# EasyEDA Pro project SD-Swicharoo.eprj, schematic SD_Swicharoo
Board Name: SDSwicharoo_Lite; Create Date: 2025-05-26; Page Name: SDSwicharoo_Lite; Project Name: Swicharoo-Final; Schematic Name: SDSwicharoo_Lite; Update Date: 2025-08-05; Company: EasyEDA.com; Page Size: A2; Version: V1.0
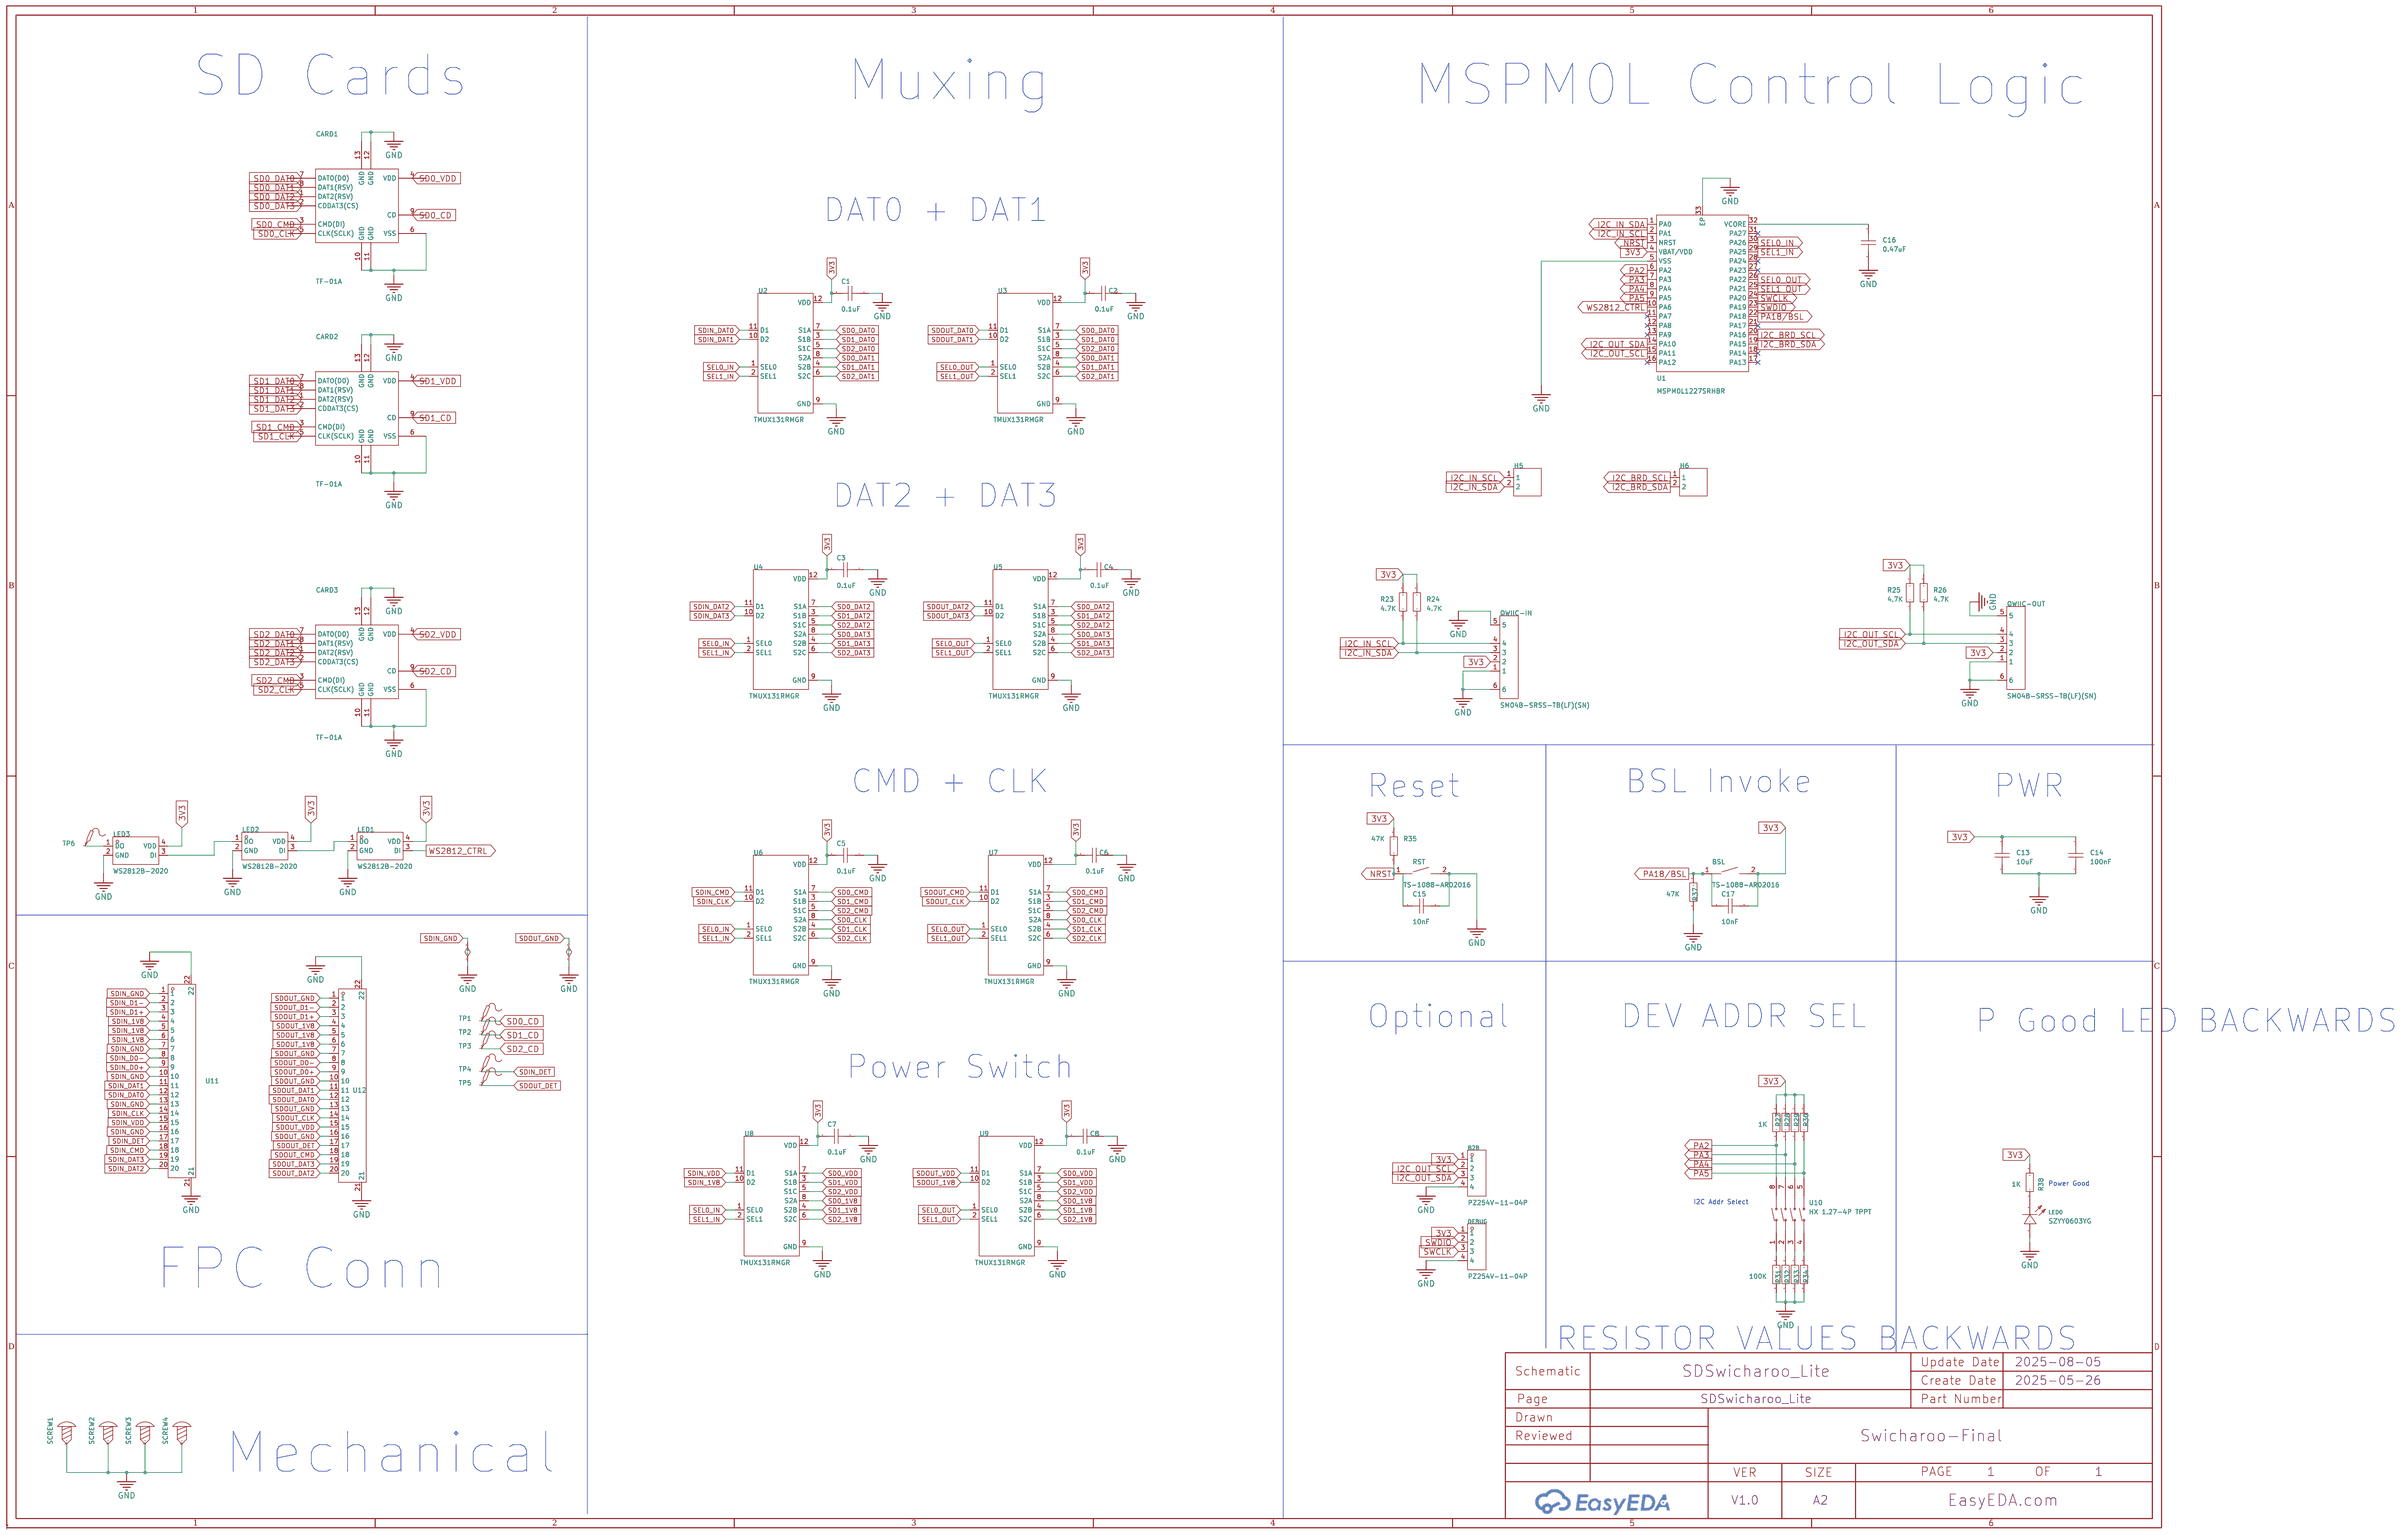
[diagram p0: schematic sheet]

## Parts
B2B  PZ254V-11-04P  [HDR-TH_4P-P2.54-V-M]  (no BOM)
BSL  TS-1088-AR02016  [SW-SMD_L3.9-W3.0-P4.45]
C1  0.1uF  [C0603]
C2  0.1uF  [C0603]
C3  0.1uF  [C0603]
C4  0.1uF  [C0603]
C5  0.1uF  [C0603]
C6  0.1uF  [C0603]
C7  0.1uF  [C0603]
C8  0.1uF  [C0603]
C13  10uF  [C0603]
C14  100nF  [C0603]
C15  10nF  [C0603]
C16  0.47uF  [C0603]
C17  10nF  [C0603]
CARD1  TF-01A  [TF-SMD_TF-01A]
CARD2  TF-01A  [TF-SMD_TF-01A]
CARD3  TF-01A  [TF-SMD_TF-01A]
DEBUG  PZ254V-11-04P  [HDR-TH_4P-P2.54-V-M]  (no BOM)
H5  -  [HDR-TH_2P-P2.54-V-M-1]  (no BOM)
H6  -  [HDR-TH_2P-P2.54-V-M-1]  (no BOM)
LED0  SZYY0603YG  [LED0603-R-RD_GREEN]
LED1  WS2812B-2020  [LED-SMD_4P-L2.0-W2.0-TL_WS2812B-2020]
LED2  WS2812B-2020  [LED-SMD_4P-L2.0-W2.0-TL_WS2812B-2020]
LED3  WS2812B-2020  [LED-SMD_4P-L2.0-W2.0-TL_WS2812B-2020]
QWIIC-IN  SM04B-SRSS-TB(LF)(SN)  [CONN-SMD_4P-P1.00_SM04B-SRSS-TB-LF-SN]
QWIIC-OUT  SM04B-SRSS-TB(LF)(SN)  [CONN-SMD_4P-P1.00_SM04B-SRSS-TB-LF-SN]
R23  4.7K  [R0603]
R24  4.7K  [R0603]
R25  4.7K  [R0603]
R26  4.7K  [R0603]
R27  1K  [R0603]
R28  1K  [R0603]
R29  1K  [R0603]
R30  1K  [R0603]
R31  100K  [R0603]
R32  1K  [R0603]
R33  1K  [R0603]
R34  1K  [R0603]
R35  47K  [R0603]
R37  47K  [R0603]
R38  1K  [R0603]
RST  TS-1088-AR02016  [SW-SMD_L3.9-W3.0-P4.45]
SCREW1  -  [Screw-Hole-M2]
SCREW2  -  [Screw-Hole-M2]
SCREW3  -  [Screw-Hole-M2]
SCREW4  -  [Screw-Hole-M2]
TP1  -  [Test-Point-0.5mm]
TP2  -  [Test-Point-0.5mm]
TP3  -  [Test-Point-0.5mm]
TP4  -  [Test-Point-0.5mm]
TP5  -  [Test-Point-0.5mm]
TP6  -  [Test-Point-0.5mm]
U1  MSPM0L1227SRHBR  [VQFN-32_L5.0-W5.0-P0.50-TL-EP3.5]
U2  TMUX131RMGR  [QFN-12L_L1.8-W1.8-P0.40-TL_TS3USB3031RMGR]
U3  TMUX131RMGR  [QFN-12L_L1.8-W1.8-P0.40-TL_TS3USB3031RMGR]
U4  TMUX131RMGR  [QFN-12L_L1.8-W1.8-P0.40-TL_TS3USB3031RMGR]
U5  TMUX131RMGR  [QFN-12L_L1.8-W1.8-P0.40-TL_TS3USB3031RMGR]
U6  TMUX131RMGR  [QFN-12L_L1.8-W1.8-P0.40-TL_TS3USB3031RMGR]
U7  TMUX131RMGR  [QFN-12L_L1.8-W1.8-P0.40-TL_TS3USB3031RMGR]
U8  TMUX131RMGR  [QFN-12L_L1.8-W1.8-P0.40-TL_TS3USB3031RMGR]
U9  TMUX131RMGR  [QFN-12L_L1.8-W1.8-P0.40-TL_TS3USB3031RMGR]
U10  HX 1.27-4P TPPT  [SW-SMD_8P-P1.27-L6.7-W5.4]
U11  05A20L20P  [FPC-SMD_20P-P0.50_L5.9-W14.4]
U12  05A20L20P  [FPC-SMD_20P-P0.50_L5.9-W14.4]

## Library data of the parts
B2B DEBUG = PZ254V-11-04P: Pin Structure:1x4P Pitch:2.54mm Row Spacing:- Circluar Pins/Square Pins:Square Pins Mounting Type:Straight Number of Rows:Plugin Number of Pins:4P Current Rating (Max):3A Voltage Rating (Max):250V Length of Mating Pin:6mm Insulation Height:2.5mm Length of; Color: Black; Pitch: 2.54mm; Supplier: LCSC; Datasheet: https://atta.szlcsc.com/upload/public/pdf/source/20200309/C492403_F9F19131791D08044AD4F84F8E751A34.pdf; Manufacturer: XFCN(兴飞); Mounting Type: Straight; Pin Structure: 1x4P; Supplier Part: C2691448; LCSC Part Name: 间距:2.54mm 1x4P 直插 方针; Number of Pins: 4P; Number of Rows: Plugin; Insulation Height: 2.5mm; JLCPCB Part Class: Extended Part; Supplier Footprint: 插件,P=2.54mm; Current Rating (Max): 3A; Length of Mating Pin: 6mm; Voltage Rating (Max): 250V; Circluar Pins/Square Pins: Square Pins; Operating Temperature Range: -40℃~+105℃; Length of End Connection Pin: 3mm; Check: false
BSL RST = TS-1088-AR02016: LCSC Part Name: 4*3*2mm 立贴 轻触开关; Supplier Part: C720477; Manufacturer: XUNPU(讯普); Supplier Footprint: SMD; JLCPCB Part Class: Basic Part; Datasheet: https://atta.szlcsc.com/upload/public/pdf/source/20200810/C720475_60D09DD6C54279ADDB2DC25100F1CC11.pdf; Supplier: LCSC; Circuit: SPST; Actuator Style: Round Button; Operating Force: 160gf; Mounting Style: Brick nogging; Switch Length: 4mm; Switch Width: 3mm; Switch Height: 2mm; Strike Gundam: 不带; Contact Current: 50mA; Voltage Rating (DC): 12V; Insulation Resistance: 100MΩ; Actuator/Cap Color: Black; Pin Style: SMDSplicing; Mechanical Life: 10万次; Operating Temperature: -30℃~+80℃
C1-C8 C13-C17 = CAP_0603: Supplier Footprint: 0603
CARD1-CARD3 = TF-01A_C91145: Card Connection Mode:Self-bouncing Card Type:MicroSD card (TF card) Connector Type:Card Slot Additional Card Detection Pins:- Supplementary Features:With Locating Pin Maximum Body Height:1.85mm Operating Temperature Range:- Operating Temperature Range:-; Supplier: LCSC; Card Type: MicroSD card (TF card); Datasheet: https://atta.szlcsc.com/upload/public/pdf/source/20190322/C91145_63CBD6FB4639A3A3EC6A9721F18AE0FB.pdf; Manufacturer: 韩国韩荣; Supplier Part: C91145; Connector Type: Card Slot; LCSC Part Name: 自弹式 MicroSD卡(TF卡) 卡座; JLCPCB Part Class: Extended Part; Supplier Footprint: SMD; Maximum Body Height: 1.85mm; Card Connection Mode: Self-bouncing; Supplementary Features: With Locating Pin
H5 H6 = HDR-M_2.54_1x2P: Supplier Footprint: Through
LED0 = SZYY0603YG: Emitted Color:Green-yellow; Supplier: LCSC; Datasheet: https://atta.szlcsc.com/upload/public/pdf/source/20191204/C434423_A1540F327AC0495CFC4F5F4A5CB9D8CC.pdf; Manufacturer: yongyu(永裕光电); Emitted Color: Green-yellow; Supplier Part: C434423; LCSC Part Name: 普绿/黄绿; JLCPCB Part Class: Extended Part; Supplier Footprint: 0603
LED1-LED3 = WS2812B-2020: LCSC Part Name: RGB三色; Supplier Part: C965555; Manufacturer: worldsemi; Supplier Footprint: SMD,2x2mm; JLCPCB Part Class: Extended Part; Datasheet: https://atta.szlcsc.com/upload/public/pdf/source/20241202/DEE3FC25B8AD87F3BB1718ACD77EDECD.pdf; Supplier: LCSC; Wavelength: 515.6nm；622.5nm；470.4nm
QWIIC-IN QWIIC-OUT = SM04B-SRSS-TB(LF)(SN): Pins Structure:1x4P Pitch:1mm Mounting Style:Horizontal attachment Reference Series:SH Number of Pins:4P Number of Rows:1 Number of PINs Per Row:4 Row Spacing:- Current Rating (Max):1A Contact Material:Copper alloy Contact Plating:Tin Operating Temperatur; Pitch: 1mm; Colour: White; Supplier: LCSC; Datasheet: https://atta.szlcsc.com/upload/public/pdf/source/20181010/C265335_7D2AD766CA0E20E745663C87507A223E.pdf; Manufacturer: JST; Supplier Part: C160404; LCSC Part Name: 1x4P 间距:1mm 卧贴 系列:SH; Mounting Style: Horizontal attachment; Number of Pins: 4P; Number of Rows: 1; Pins Structure: 1x4P; Contact Plating: Tin; Contact Material: Copper alloy; Plastic Material: PA; Reference Series: SH; JLCPCB Part Class: Extended Part; Supplier Footprint: SMD,P=1mm,卧贴; Rated Voltage (Max): 50V; Current Rating (Max): 1A; Z-Height of the Board: 2.9mm; Flame Retardant Rating: UL94V-0; Number of PINs Per Row: 4; Supplementary Features: Auxiliary soldering legs; Operating Temperature Range: -25℃~+85℃; Y-Width of Bottom Edge on Board: 4.32mm; X-Length of Bottom Edge on Board (Spacing Line): 6mm
R23-R35 R37 R38 = Res_0603: Supplier Footprint: 0603
SCREW1-SCREW4 = Screw-Hole-M2: Supplier Footprint: 插件
TP1-TP6 = Test-Point
U1 = MSPM0L1227SRHBR: Supplier Part: C42836166; Manufacturer: TI(德州仪器); Supplier Footprint: VQFN-32(5x5); JLCPCB Part Class: Extended Part; Datasheet: https://www.ti.com.cn/cn/lit/ds/symlink/mspm0l1227.pdf; Supplier: LCSC
U2-U9 = TMUX131RMGR: Switch Circuit:Triple pole single throw (3PST) Number of Channels:2 Voltage - Supply:2.5V~4.3V Voltage - Supply:2.5V~4.3V Turn-on time:100us RDS(on):7Ω Turn-off time:100us Operating Temperature:-40℃~+85℃ Operating Temperature:-40℃~+85℃; RDS(on): 7Ω; Supplier: LCSC; Manufacturer: TI(德州仪器); Turn-on time: 100us; Supplier Part: C22396276; Turn-off time: 100us; LCSC Part Name: TMUX131 4V，低电容，3:1 2通道多路复用器; Switch Circuit: Triple pole single throw (3PST); Voltage - Supply: 2.5V~4.3V; JLCPCB Part Class: Extended Part; Number of Channels: 2; Supplier Footprint: WQFN-12(1.8x1.8); Operating Temperature: -40℃~+85℃
U10 = HX 1.27-4P TPPT: Type:平拨,凹槽式 Circuit:SPST Number of Positions:4Bit Lead Pitch:1.27mm Current Rating:25mA Voltage Rating:24V Operating Life:3千次 Color:Black; Type: 平拨,凹槽式; Color: Black; Circuit: SPST; Supplier: LCSC; Datasheet: https://atta.szlcsc.com/upload/public/pdf/source/20240410/43256CD1E9DCFD5DA805AF843E5BED4C.pdf; Lead Pitch: 1.27mm; Manufacturer: hanxia(韩下); Supplier Part: C7430300; Current Rating: 25mA; LCSC Part Name: 拨码开关 贴片平拨 4位 1.27间距; Operating Life: 3千次; Voltage Rating: 24V; JLCPCB Part Class: Extended Part; Supplier Footprint: SMD; Number of Positions: 4Bit
U11 U12 = 05A20L20P: Locking Feature:Flip type Contact Type:Bottom Contact Number of Contacts:20P Pitch:0.5mm Height Above Board:2mm Contact Plating:Tin; Pitch: 0.5mm; Supplier: LCSC; Datasheet: https://atta.szlcsc.com/upload/public/pdf/source/20230308/6F45CD0D9168BB8DDA2BFAAC08B4D6F4.pdf; Contact Type: Bottom Contact; Manufacturer: HanElectricity(瀚源); Supplier Part: C5362157; LCSC Part Name: 翻盖式 下接 P数:20P 间距:0.5mm; Contact Plating: Tin; Locking Feature: Flip type; JLCPCB Part Class: Extended Part; Height Above Board: 2mm; Number of Contacts: 20P; Supplier Footprint: SMD,P=0.5mm

## Nets
3V3: B2B.1 BSL.2 C1.2 C2.2 C3.2 C4.2 C5.2 C6.2 C7.2 C8.2 C13.1 C14.1 C17.2 DEBUG.1 LED1.4(VDD) LED2.4(VDD) LED3.4(VDD) QWIIC-IN.2 QWIIC-OUT.2 R23.2 R24.2 R25.2 R26.2 R27.2 R28.2 R29.2 R30.2 R35.2 R38.2 U1.4(VBAT/VDD) U2.12(VDD) U3.12(VDD) U4.12(VDD) U5.12(VDD) U6.12(VDD) U7.12(VDD) U8.12(VDD) U9.12(VDD)
GND: B2B.4 C1.1 C2.1 C3.1 C4.1 C5.1 C6.1 C7.1 C8.1 C13.2 C14.2 C15.2 C16.2 CARD1.6(VSS) CARD1.10(GND) CARD1.11(GND) CARD1.12(GND) CARD1.13(GND) CARD2.6(VSS) CARD2.10(GND) CARD2.11(GND) CARD2.12(GND) CARD2.13(GND) CARD3.6(VSS) CARD3.10(GND) CARD3.11(GND) CARD3.12(GND) CARD3.13(GND) DEBUG.4 LED0.1(+) LED1.2(GND) LED2.2(GND) LED3.2(GND) QWIIC-IN.1 QWIIC-IN.5 QWIIC-IN.6 QWIIC-OUT.1 QWIIC-OUT.5 QWIIC-OUT.6 R31.1 R32.1 R33.1 R34.1 R37.1 RST.2 SCREW1.1 SCREW2.1 SCREW3.1 SCREW4.1 U1.5(VSS) U1.33(EP) U2.9(GND) U3.9(GND) U4.9(GND) U5.9(GND) U6.9(GND) U7.9(GND) U8.9(GND) U9.9(GND) U11.1 U11.7 U11.10 U11.13 U11.16 U11.21 U11.22 U12.1 U12.7 U12.10 U12.13 U12.16 U12.21 U12.22
I2C_BRD_SCL: H6.1 U1.20(PA16)
I2C_BRD_SDA: H6.2 U1.19(PA15)
I2C_IN_SCL: H5.1 QWIIC-IN.4 R23.1 U1.2(PA1)
I2C_IN_SDA: H5.2 QWIIC-IN.3 R24.1 U1.1(PA0)
I2C_OUT_SCL: B2B.2 QWIIC-OUT.4 R25.1 U1.15(PA11)
I2C_OUT_SDA: B2B.3 QWIIC-OUT.3 R26.1 U1.14(PA10)
NRST: C15.1 R35.1 RST.1 U1.3(NRST)
PA2: R27.1 U1.6(PA2) U10.8
PA3: R28.1 U1.7(PA3) U10.7
PA4: R29.1 U1.8(PA4) U10.6
PA5: R30.1 U1.9(PA5) U10.5
PA18/BSL: BSL.1 C17.1 R37.2 U1.22(PA18)
SD0_1V8: U8.8(S2A) U9.8(S2A)
SD0_CD: CARD1.9(CD) TP1.1
SD0_CLK: CARD1.5(CLK(SCLK)) U6.8(S2A) U7.8(S2A)
SD0_CMD: CARD1.3(CMD(DI)) U6.7(S1A) U7.7(S1A)
SD0_DAT0: CARD1.7(DAT0(D0)) U2.7(S1A) U3.7(S1A)
SD0_DAT1: CARD1.8(DAT1(RSV)) U2.8(S2A) U3.8(S2A)
SD0_DAT2: CARD1.1(DAT2(RSV)) U4.7(S1A) U5.7(S1A)
SD0_DAT3: CARD1.2(CDDAT3(CS)) U4.8(S2A) U5.8(S2A)
SD0_VDD: CARD1.4(VDD) U8.7(S1A) U9.7(S1A)
SD1_1V8: U8.4(S2B) U9.4(S2B)
SD1_CD: CARD2.9(CD) TP2.1
SD1_CLK: CARD2.5(CLK(SCLK)) U6.4(S2B) U7.4(S2B)
SD1_CMD: CARD2.3(CMD(DI)) U6.3(S1B) U7.3(S1B)
SD1_DAT0: CARD2.7(DAT0(D0)) U2.3(S1B) U3.3(S1B)
SD1_DAT1: CARD2.8(DAT1(RSV)) U2.4(S2B) U3.4(S2B)
SD1_DAT2: CARD2.1(DAT2(RSV)) U4.3(S1B) U5.3(S1B)
SD1_DAT3: CARD2.2(CDDAT3(CS)) U4.4(S2B) U5.4(S2B)
SD1_VDD: CARD2.4(VDD) U8.3(S1B) U9.3(S1B)
SD2_1V8: U8.6(S2C) U9.6(S2C)
SD2_CD: CARD3.9(CD) TP3.1
SD2_CLK: CARD3.5(CLK(SCLK)) U6.6(S2C) U7.6(S2C)
SD2_CMD: CARD3.3(CMD(DI)) U6.5(S1C) U7.5(S1C)
SD2_DAT0: CARD3.7(DAT0(D0)) U2.5(S1C) U3.5(S1C)
SD2_DAT1: CARD3.8(DAT1(RSV)) U2.6(S2C) U3.6(S2C)
SD2_DAT2: CARD3.1(DAT2(RSV)) U4.5(S1C) U5.5(S1C)
SD2_DAT3: CARD3.2(CDDAT3(CS)) U4.6(S2C) U5.6(S2C)
SD2_VDD: CARD3.4(VDD) U8.5(S1C) U9.5(S1C)
SDIN_1V8: U8.10(D2) U11.4 U11.5 U11.6
SDIN_CLK: U6.10(D2) U11.14
SDIN_CMD: U6.11(D1) U11.18
SDIN_D0+: U11.9
SDIN_D0-: U11.8
SDIN_D1+: U11.3
SDIN_D1-: U11.2
SDIN_DAT0: U2.11(D1) U11.12
SDIN_DAT1: U2.10(D2) U11.11
SDIN_DAT2: U4.11(D1) U11.20
SDIN_DAT3: U4.10(D2) U11.19
SDIN_DET: TP4.1 U11.17
SDIN_VDD: U8.11(D1) U11.15
SDOUT_1V8: U9.10(D2) U12.4 U12.5 U12.6
SDOUT_CLK: U7.10(D2) U12.14
SDOUT_CMD: U7.11(D1) U12.18
SDOUT_D0+: U12.9
SDOUT_D0-: U12.8
SDOUT_D1+: U12.3
SDOUT_D1-: U12.2
SDOUT_DAT0: U3.11(D1) U12.12
SDOUT_DAT1: U3.10(D2) U12.11
SDOUT_DAT2: U5.11(D1) U12.20
SDOUT_DAT3: U5.10(D2) U12.19
SDOUT_DET: TP5.1 U12.17
SDOUT_VDD: U9.11(D1) U12.15
SEL0_IN: U1.30(PA26) U2.1(SEL0) U4.1(SEL0) U6.1(SEL0) U8.1(SEL0)
SEL0_OUT: U1.26(PA22) U3.1(SEL0) U5.1(SEL0) U7.1(SEL0) U9.1(SEL0)
SEL1_IN: U1.29(PA25) U2.2(SEL1) U4.2(SEL1) U6.2(SEL1) U8.2(SEL1)
SEL1_OUT: U1.25(PA21) U3.2(SEL1) U5.2(SEL1) U7.2(SEL1) U9.2(SEL1)
SWCLK: DEBUG.3 U1.24(PA20)
SWDIO: DEBUG.2 U1.23(PA19)
WS2812_CTRL: LED1.3(DI) U1.10(PA6)
$1N18187: R31.2 U10.1
$1N18188: R32.2 U10.2
$1N18189: R33.2 U10.3
$1N18190: R34.2 U10.4
$1N18221: C16.1 U1.32(VCORE)
$1N24796: LED3.1(DO) TP6.1
$1N24800: LED2.1(DO) LED3.3(DI)
$1N24806: LED1.1(DO) LED2.3(DI)
Net-(LED0-2): LED0.2(-) R38.1

Not connected (* = marked no-connect by the designer): U1 11(PA7)* 12(PA8)* 13(PA9)* 16(PA12)* 17(PA13)* 18(PA14)* 21(PA17)* 27(PA23)* 28(PA24)* 31(PA27)*

## Notes on the sheet
- SD Cards
- Muxing
- MSPM0L Control Logic
- DAT0 + DAT1
- DAT2 + DAT3
- CMD + CLK
- Reset
- BSL Invoke
- PWR
- Optional
- DEV ADDR SEL
- P Good LED BACKWARDS
- Power Switch
- Power Good
- I2C Addr Select
- FPC Conn
- RESISTOR VALUES BACKWARDS
- Mechanical
